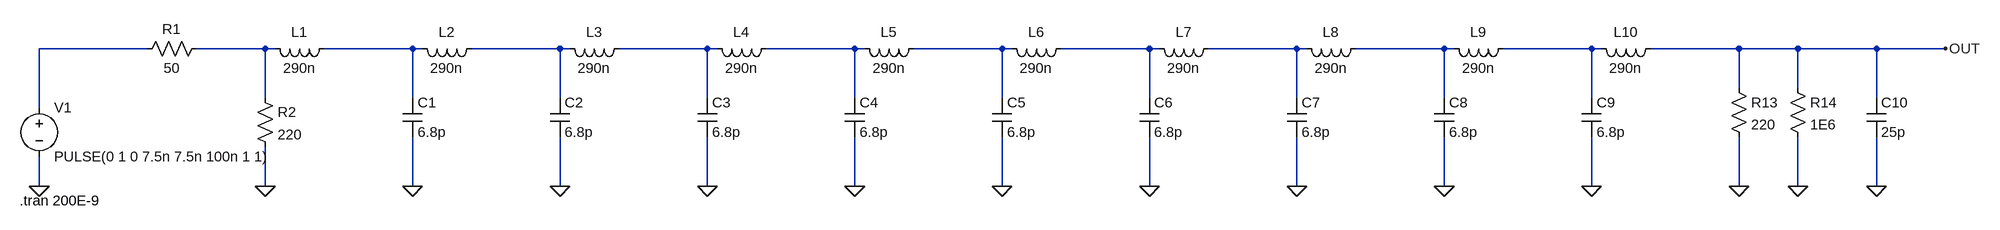
[diagram p0: schematic 10 cell_no Ri.asc]
10 cell_no Ri.asc, the LTspice schematic file:
Version 4
SHEET 1 1444 680
WIRE -1552 32 -1728 32
WIRE -1360 32 -1472 32
WIRE -1344 32 -1360 32
WIRE -1120 32 -1264 32
WIRE -1104 32 -1120 32
WIRE -880 32 -1024 32
WIRE -864 32 -880 32
WIRE -640 32 -784 32
WIRE -624 32 -640 32
WIRE -400 32 -544 32
WIRE -384 32 -400 32
WIRE -160 32 -304 32
WIRE -144 32 -160 32
WIRE 80 32 -64 32
WIRE 96 32 80 32
WIRE 320 32 176 32
WIRE 336 32 320 32
WIRE 560 32 416 32
WIRE 576 32 560 32
WIRE 800 32 656 32
WIRE 816 32 800 32
WIRE 1040 32 896 32
WIRE 1136 32 1040 32
WIRE 1264 32 1136 32
WIRE 1376 32 1264 32
WIRE 1040 96 1040 32
WIRE 1136 96 1136 32
WIRE -1360 112 -1360 32
WIRE -1120 112 -1120 32
WIRE -880 112 -880 32
WIRE -640 112 -640 32
WIRE -400 112 -400 32
WIRE -160 112 -160 32
WIRE 80 112 80 32
WIRE 320 112 320 32
WIRE 560 112 560 32
WIRE 800 112 800 32
WIRE 1264 112 1264 32
WIRE -1728 128 -1728 32
WIRE -1728 256 -1728 208
WIRE -1360 256 -1360 192
WIRE -1120 256 -1120 176
WIRE -880 256 -880 176
WIRE -640 256 -640 176
WIRE -400 256 -400 176
WIRE -160 256 -160 176
WIRE 80 256 80 176
WIRE 320 256 320 176
WIRE 560 256 560 176
WIRE 800 256 800 176
WIRE 1040 256 1040 176
WIRE 1136 256 1136 176
WIRE 1264 256 1264 176
FLAG -1728 256 0
FLAG -1360 256 0
FLAG -1120 256 0
FLAG -880 256 0
FLAG -640 256 0
FLAG -400 256 0
FLAG -160 256 0
FLAG 80 256 0
FLAG 320 256 0
FLAG 560 256 0
FLAG 800 256 0
FLAG 1040 256 0
FLAG 1136 256 0
FLAG 1264 256 0
FLAG 1376 32 OUT
SYMBOL voltage -1728 112 R0
WINDOW 123 0 0 Left 0
WINDOW 39 0 0 Left 0
SYMATTR InstName V1
SYMATTR Value PULSE(0 1 0 7.5n 7.5n 100n 1 1)
SYMBOL res -1456 16 R90
WINDOW 0 0 56 VBottom 2
WINDOW 3 32 56 VTop 2
SYMATTR InstName R1
SYMATTR Value 50
SYMBOL res -1376 96 R0
SYMATTR InstName R2
SYMATTR Value 220
SYMBOL ind -1248 16 R90
WINDOW 0 5 56 VBottom 2
WINDOW 3 32 56 VTop 2
SYMATTR InstName L1
SYMATTR Value 290n
SYMBOL cap -1136 112 R0
SYMATTR InstName C1
SYMATTR Value 6.8p
SYMBOL ind -1008 16 R90
WINDOW 0 5 56 VBottom 2
WINDOW 3 32 56 VTop 2
SYMATTR InstName L2
SYMATTR Value 290n
SYMBOL cap -896 112 R0
SYMATTR InstName C2
SYMATTR Value 6.8p
SYMBOL ind -768 16 R90
WINDOW 0 5 56 VBottom 2
WINDOW 3 32 56 VTop 2
SYMATTR InstName L3
SYMATTR Value 290n
SYMBOL cap -656 112 R0
SYMATTR InstName C3
SYMATTR Value 6.8p
SYMBOL ind -528 16 R90
WINDOW 0 5 56 VBottom 2
WINDOW 3 32 56 VTop 2
SYMATTR InstName L4
SYMATTR Value 290n
SYMBOL cap -416 112 R0
SYMATTR InstName C4
SYMATTR Value 6.8p
SYMBOL ind -288 16 R90
WINDOW 0 5 56 VBottom 2
WINDOW 3 32 56 VTop 2
SYMATTR InstName L5
SYMATTR Value 290n
SYMBOL cap -176 112 R0
SYMATTR InstName C5
SYMATTR Value 6.8p
SYMBOL ind -48 16 R90
WINDOW 0 5 56 VBottom 2
WINDOW 3 32 56 VTop 2
SYMATTR InstName L6
SYMATTR Value 290n
SYMBOL cap 64 112 R0
SYMATTR InstName C6
SYMATTR Value 6.8p
SYMBOL ind 192 16 R90
WINDOW 0 5 56 VBottom 2
WINDOW 3 32 56 VTop 2
SYMATTR InstName L7
SYMATTR Value 290n
SYMBOL cap 304 112 R0
SYMATTR InstName C7
SYMATTR Value 6.8p
SYMBOL ind 432 16 R90
WINDOW 0 5 56 VBottom 2
WINDOW 3 32 56 VTop 2
SYMATTR InstName L8
SYMATTR Value 290n
SYMBOL cap 544 112 R0
SYMATTR InstName C8
SYMATTR Value 6.8p
SYMBOL ind 672 16 R90
WINDOW 0 5 56 VBottom 2
WINDOW 3 32 56 VTop 2
SYMATTR InstName L9
SYMATTR Value 290n
SYMBOL cap 784 112 R0
SYMATTR InstName C9
SYMATTR Value 6.8p
SYMBOL ind 912 16 R90
WINDOW 0 5 56 VBottom 2
WINDOW 3 32 56 VTop 2
SYMATTR InstName L10
SYMATTR Value 290n
SYMBOL res 1024 80 R0
SYMATTR InstName R13
SYMATTR Value 220
SYMBOL res 1120 80 R0
SYMATTR InstName R14
SYMATTR Value 1E6
SYMBOL cap 1248 112 R0
SYMATTR InstName C10
SYMATTR Value 25p
TEXT -1760 280 Left 2 !.tran 200E-9

The netlist it stands for:
* 10 cell_no Ri.asc
V1 N001 0 PULSE(0 1 0 7.5n 7.5n 100n 1 1)
R1 N002 N001 50
R2 N002 0 220
L1 N003 N002 290n
C1 N003 0 6.8p
L2 N004 N003 290n
C2 N004 0 6.8p
L3 N005 N004 290n
C3 N005 0 6.8p
L4 N006 N005 290n
C4 N006 0 6.8p
L5 N007 N006 290n
C5 N007 0 6.8p
L6 N008 N007 290n
C6 N008 0 6.8p
L7 N009 N008 290n
C7 N009 0 6.8p
L8 N010 N009 290n
C8 N010 0 6.8p
L9 N011 N010 290n
C9 N011 0 6.8p
L10 OUT N011 290n
R13 OUT 0 220
R14 OUT 0 1E6
C10 OUT 0 25p
.tran 200E-9
.backanno
.end